# EAGLE design T3HornetV2 (EAGLE 6.5.0)
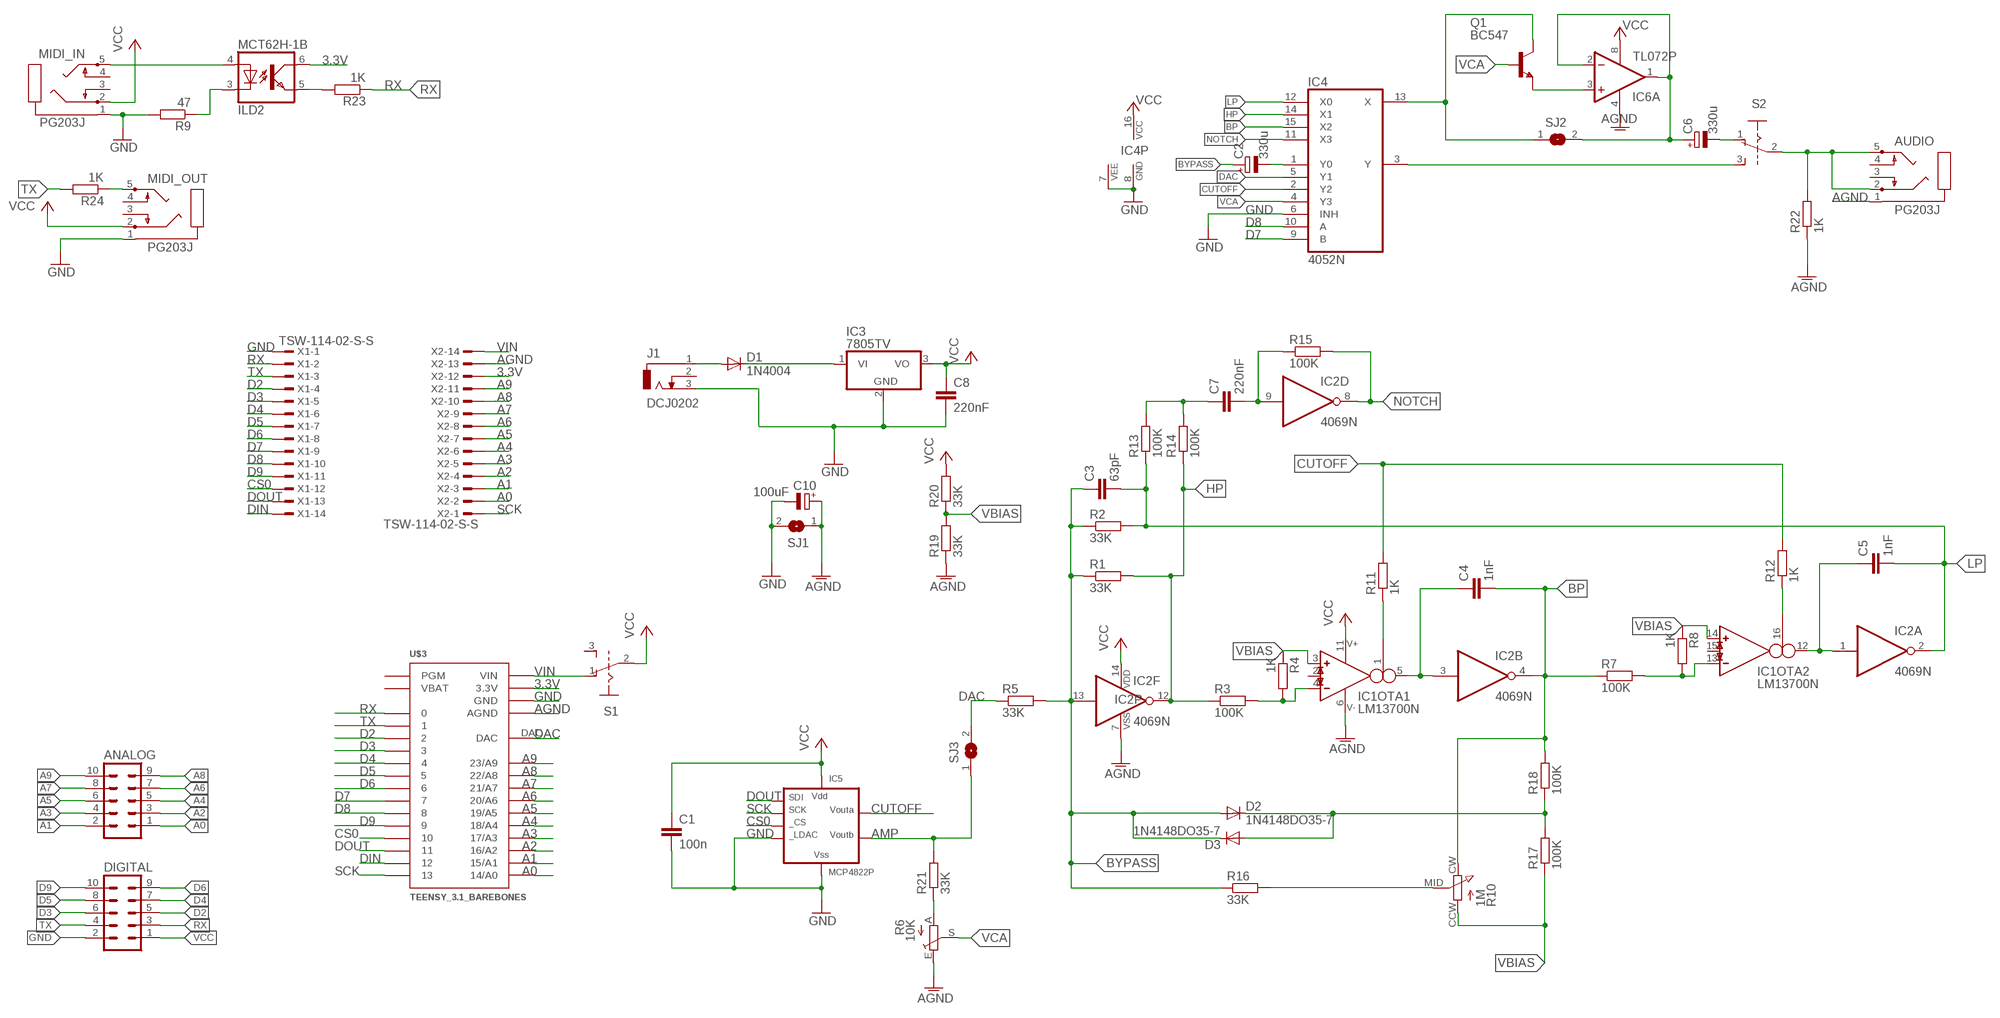
[diagram p0: schematic, sheet 1]

## Parts
ANALOG  ML10  [ML10]
AUDIO  PG203J  [PG203J]
C1  100n  C-EU050-030X075  [C050-030X075]
C2  330u  CPOL-EUE2.5-7  [E2,5-7]
C3  63pF  C-EU025-024X044  [C025-024X044]
C4  1nF  C-EU025-024X044  [C025-024X044]
C5  1nF  C-EU025-024X044  [C025-024X044]
C6  330u  CPOL-EUE2.5-7  [E2,5-7]
C7  220nF  C-EU050-030X075  [C050-030X075]
C8  220nF  C-EU050-030X075  [C050-030X075]
C10  100uF  CPOL-EUE2.5-6  [E2,5-6]
D1  1N4004  [DO41-10]
D2  1N4148DO35-7  [DO35-7]
D3  1N4148DO35-7  [DO35-7]
DIGITAL  ML10  [ML10]
IC1  LM13700N  [DIL16]
IC2  4069N  [DIL14]
IC3  7805TV  [TO220V]
IC4  4052N  [DIL16]
IC5  MCP4822P  [DIL8]
IC6  TL072P  [DIL08]
J1  DCJ0202  [DCJ0202]
MCT62H-1  ILD2  [DIL08]
MIDI_IN  PG203J  [PG203J]
MIDI_OUT  PG203J  [PG203J]
Q1  BC547  [TO92]
R1  33K  R-EU_0207/7  [0207/7]
R2  33K  R-EU_0207/7  [0207/7]
R3  100K  R-EU_0207/7  [0207/7]
R4  1K  R-EU_0207/7  [0207/7]
R5  33K  R-EU_0207/7  [0207/7]
R6  10K  TRIM_EU-CA9V  [CA9V]
R7  100K  R-EU_0207/7  [0207/7]
R8  1K  R-EU_0207/7  [0207/7]
R9  47  R-EU_0207/7  [0207/7]
R10  1M  P120PK  [P120PK]
R11  1K  R-EU_0207/7  [0207/7]
R12  1K  R-EU_0207/7  [0207/7]
R13  100K  R-EU_0207/7  [0207/7]
R14  100K  R-EU_0207/7  [0207/7]
R15  100K  R-EU_0207/7  [0207/7]
R16  33K  R-EU_0207/7  [0207/7]
R17  100K  R-EU_0207/7  [0207/7]
R18  100K  R-EU_0207/7  [0207/7]
R19  33K  R-EU_0207/7  [0207/7]
R20  33K  R-EU_0207/7  [0207/7]
R21  33K  R-EU_0207/7  [0207/7]
R22  1K  R-EU_0207/7  [0207/7]
R23  1K  R-EU_0207/7  [0207/7]
R24  1K  R-EU_0207/7  [0207/7]
S1  EG1218  [GF-126-0159]
S2  EG1218  [GF-126-0159]
SJ1  SJ  [SJ]
SJ2  SJ  [SJ]
SJ3  SJ  [SJ]
U$3  TEENSY_3.1_BAREBONES  [TEENSY_3.1_BAREBONES]
X1  TSW-114-02-S-S  [TSW-114-02-S-S]
X2  TSW-114-02-S-S  [TSW-114-02-S-S]

## Nets
3.3V [power]: MCT62H-1.6(B:COL) U$3.3.3V1(3.3V) U$3.3.3V2(3.3V) X2.12
A0: ANALOG.1 U$3.14/A0 X2.2
A1: ANALOG.2 U$3.15/A1 X2.3
A2: ANALOG.3 U$3.16/A2 X2.4
A3: ANALOG.4 U$3.17/A3 X2.5
A4: ANALOG.5 U$3.18/A4 X2.6
A5: ANALOG.6 U$3.19/A5 X2.7
A6: ANALOG.7 U$3.20/A6 X2.8
A7: ANALOG.8 U$3.21/A7 X2.9
A8: ANALOG.9 U$3.22/A8 X2.10
A9: ANALOG.10 U$3.23/A9 X2.11
AGND [power]: AUDIO.1 C10.+ IC1.6(SUPPLY:V-) IC2.7(P:VSS) IC6.4(P:V-) R6.E R19.1 R22.1 SJ1.1 U$3.AGND X2.13
AMP: IC5.6(VOUTB) R21.2 SJ3.1
BP: C4.2 IC2.4(B:O) IC4.15(X2) R7.1 R10.CW R18.2
BYPASS: C2.+ C3.1 D2.A D3.C IC2.13(F:I) R1.1 R2.1 R5.2 R16.1
CS0: IC5.2(CS) U$3.10 X1.12
CUTOFF: IC4.2(Y2) IC5.8(VOUTA) R11.2 R12.2
D2: DIGITAL.5 U$3.2 X1.4
D3: DIGITAL.6 U$3.3 X1.5
D4: DIGITAL.7 U$3.4 X1.6
D5: DIGITAL.8 U$3.5 X1.7
D6: DIGITAL.9 U$3.6 X1.8
D7: IC4.9(B) U$3.7 X1.9
D8: IC4.10(A) U$3.8 X1.10
D9: DIGITAL.10 U$3.9 X1.11
DAC: IC4.5(Y1) R5.1 SJ3.2 U$3.DAC
DIN: U$3.12 X1.14
DOUT: IC5.4(SDI) U$3.11 X1.13
GND [power]: C1.2 C8.2 C10.- DIGITAL.2 IC3.2(GND) IC4.6(INH) IC4.7(VEE) IC4.8(GND) IC5.5(LDAC) IC5.7(VSS) J1.3 MIDI_IN.1 MIDI_OUT.1 R9.2 SJ1.2 U$3.GND1(GND) U$3.GND2(GND) X1.1
HP: IC2.12(F:O) IC4.14(X1) R1.2 R3.1 R14.1
LP: C3.2 C5.2 IC2.2(A:O) IC4.12(X0) R2.2 R13.1
N$1: D1.A J1.1
N$2: IC6.3(A:+IN) Q1.1(E)
N$3: D2.C D3.A R17.2 R18.1
N$4: R6.A R21.1
N$5: IC1.4(OTA1:IN_N) R3.2 R4.2
N$6: C6.- S2.1
N$7: C4.1 IC1.5(OTA1:OUT) IC2.3(B:I)
N$8: R10.MID R16.2
N$9: IC1.13(OTA2:IN_N) R7.2 R8.2
N$10: IC4.3(Y) S2.3
N$11: C5.1 IC1.12(OTA2:OUT) IC2.1(A:I)
N$12: C7.2 IC2.9(D:I) R15.1
N$13: IC1.1(OTA1:I_BIAS) R11.1
N$14: IC1.16(OTA2:I_BIAS) R12.1
N$15: C7.1 R13.2 R14.2
N$16: D1.C IC3.1(VI)
N$17: C6.+ IC6.1(A:OUT) IC6.2(A:-IN) SJ2.2
N$18: C2.- IC4.1(Y0)
N$19: AUDIO.2 AUDIO.5 R22.2 S2.2
N$20: IC4.13(X) Q1.3(C) SJ2.1
N$21: MCT62H-1.5(B:EMIT) R23.2
N$22: MIDI_OUT.5 R24.1
N$23: MCT62H-1.4(B:A) MIDI_IN.5
N$27: MCT62H-1.3(B:C) R9.1
NOTCH: IC2.8(D:O) IC4.11(X3) R15.2
RX: DIGITAL.3 R23.1 U$3.0 X1.2
SCK: IC5.3(SCK) U$3.13 X2.1
TX: DIGITAL.4 R24.2 U$3.1 X1.3
VBIAS: IC1.3(OTA1:IN_P) IC1.14(OTA2:IN_P) R4.1 R8.1 R10.CCW R17.1 R19.2 R20.1
VCA: IC4.4(Y3) Q1.2(B) R6.S
VCC: C1.1 C8.1 DIGITAL.1 IC1.11(SUPPLY:V+) IC2.14(P:VDD) IC3.3(VO) IC4.16(VCC) IC5.1(VDD) IC6.8(P:V+) MIDI_IN.2 MIDI_OUT.2 R20.2 S1.2
VIN: S1.1 U$3.VIN X2.14
Unconnected: AUDIO.3 AUDIO.4 IC1.2(OTA1:I_DIODE) IC1.7(BUF1:B) IC1.8(BUF1:E) IC1.9(BUF2:E) IC1.10(BUF2:B) IC1.15(OTA2:I_DIODE) IC2.5(C:I) IC2.6(C:O) IC2.10(E:O) IC2.11(E:I) IC6.5(B:+IN) IC6.6(B:-IN) IC6.7(B:OUT) J1.2 MCT62H-1.1(A:A) MCT62H-1.2(A:C) MCT62H-1.7(A:COL) MCT62H-1.8(A:EMIT) MIDI_IN.3 MIDI_IN.4 MIDI_OUT.3 MIDI_OUT.4 S1.3 U$3.PGM

## Power pins joined to a net without a drawn wire
VBAT: U$3.VBAT

## Library data of the parts
ANALOG DIGITAL = con-harting-ml:ML10: HARTING
AUDIO MIDI_IN MIDI_OUT = con-hirschmann:PG203J: MIC/HEADPHONE JACK KS-S stereo microphone/headphone jack PG203JN (Schukat)
C1 C3-C5 C7 C8 = rcl:C-EU: CAPACITOR, European symbol
C2 C6 C10 = rcl:CPOL-EU: POLARIZED CAPACITOR, European symbol
D1 = diode:1N4004: DIODE general purpose rectifier, 1 A
D2 D3 = diode:1N4148: DIODE high speed (Philips)
IC1 = ota:LM13700: Dual OTA with buffers
IC2 = 40xx:4069: Hex INVERTER
IC3 = linear:78*: Positive VOLTAGE REGULATOR Source: http://cache.national.com/ds/LM/LM78L05.pdf http://www.fairchildsemi.com/ds/LM/LM7805.pdf
IC4 = 40xx:4052: Dual 4-channel ANALOG MULTIPLEXER
IC5 = microchip-dac:MCP4822: MCP4822: 12-bit dual DAC MCP4802/4812/4822 - 8/10/12-Bit Dual Voltage Output Digital-to-Analog Converter with Internal VREF and SPI Interface The MCP48x2 devices are dual 8-bit, 10-bit and 12-bit buffered voltage output Digital-to-Analog Converters (DACs), respectively. The devices operate from a single 2.7V to 5.5V supply with SPI compatible Serial Peripheral Interface. The devices have a high precision internal voltage reference (VREF = 2.048V). The user can configure the full-scale range of the device to be 2.048V or 4.096V by setting the Gain Selection Option bit (gain of 1 of 2). RobG
IC6 = linear:TL072: OP AMP
J1 = con-jack:DCJ0202: DC POWER JACK Source: DCJ0202.pdf; OC_FARNELL: unknown; OC_NEWARK: unknown
MCT62H-1 = optocoupler:ILD2: SIEMENS OPTO COUPLER; OC_FARNELL: 1469596; OC_NEWARK: unknown
Q1 = transistor-npn:BC547*: NPN Transistor
R1-R5 R7-R9 R11-R24 = rcl:R-EU_: RESISTOR, European symbol
R6 = pot:TRIM_EU-: POTENTIOMETER
R10 = videomusik:P120PK
S1 S2 = videomusik:EG1218
SJ1-SJ3 = jumper:SJ: SMD solder JUMPER
U$3 = Teensy3.0:TEENSY_3.1_BAREBONES
X1 X2 = con-samtec:TSW-114-02-S-S: THROUGH-HOLE .025" SQ POST HEADER Source: Samtec TSW.pdf; OC_FARNELL: unknown; OC_NEWARK: unknown

## Net classes
1 power: width 0.61 mm

## Board
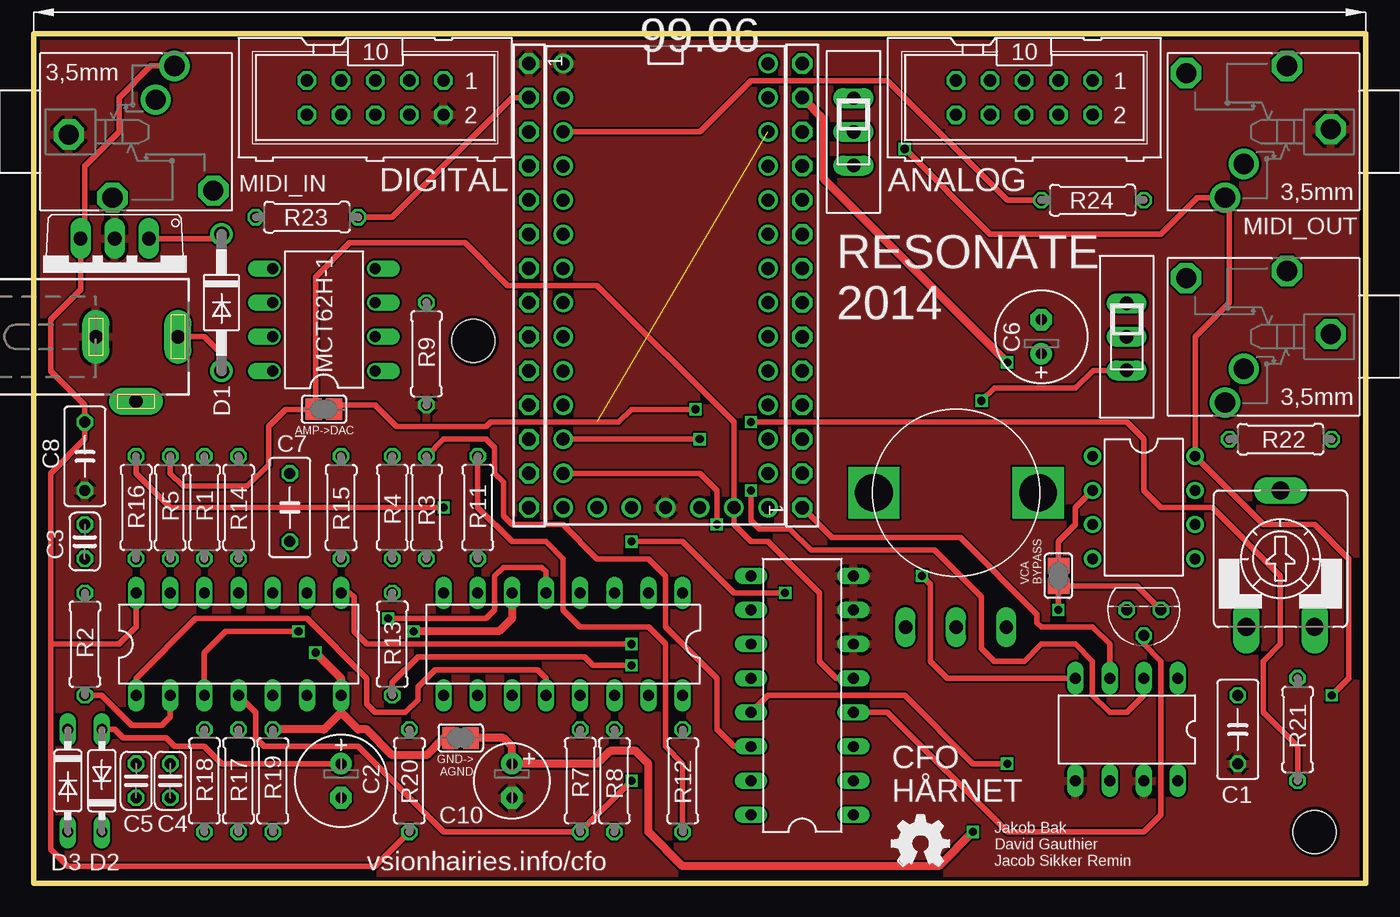
[diagram p1: board, top side]
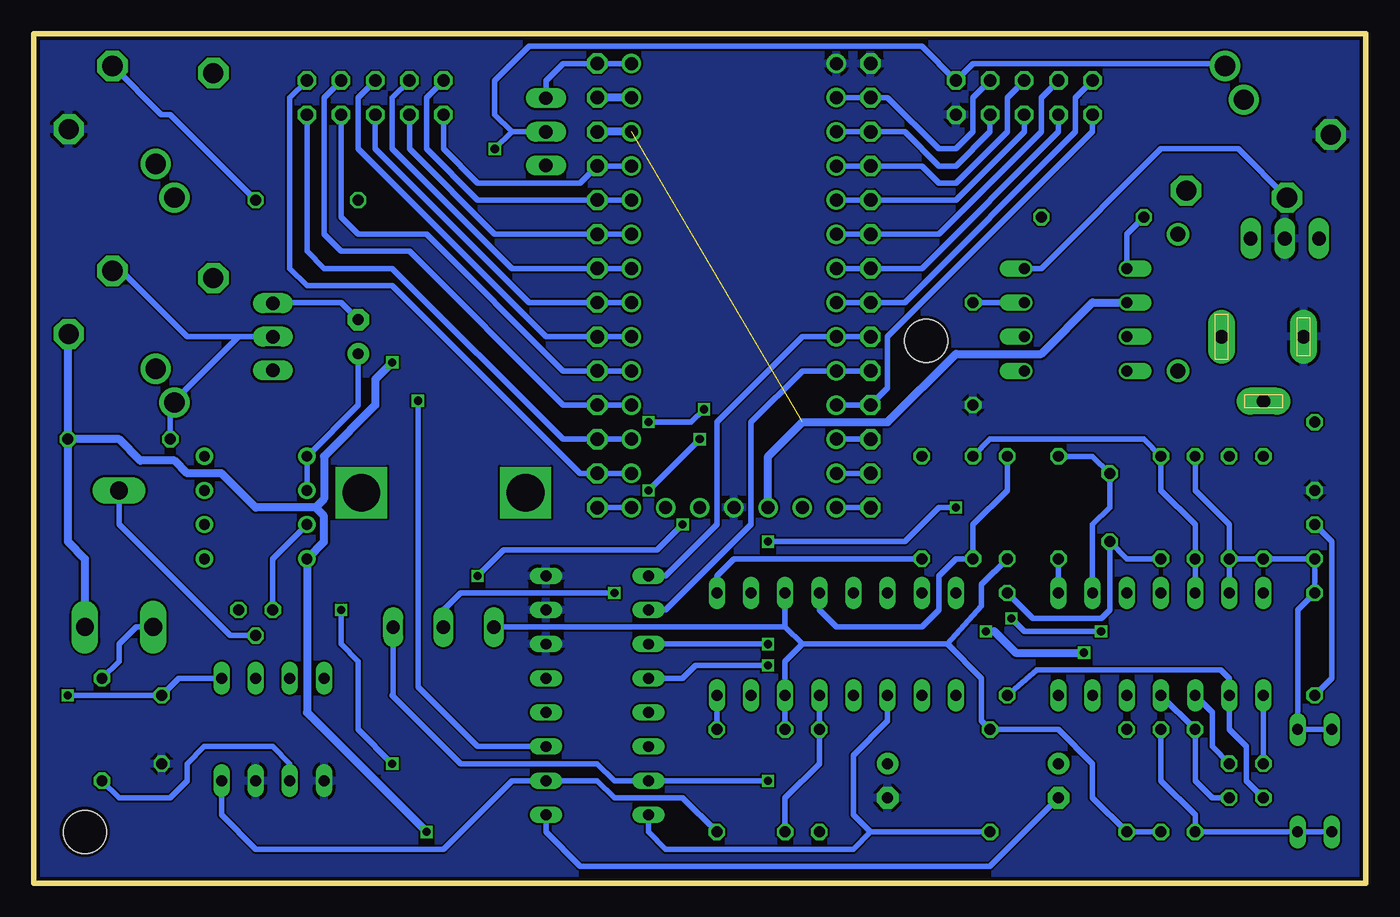
[diagram p2: board, bottom side, seen from below]

Size 99.06 x 63.18 mm. Coordinates in mm from the lower left corner, seen from the top.
Outline: 0,0 99.06,0 99.06,63.18 0,63.17 0,0
Copper layers (1*2*15*16): Top 0.035mm / dielectric 0.2mm / layer 2 0.0175mm / dielectric 1.1mm / layer 15 0.0175mm / dielectric 0.2mm / Bottom 0.035mm
Design rules "SeeedStudio_DRU_no_angle_20130527": minimum track width 6mil, minimum drill 12mil, track to track 6mil, track to pad 6mil, pad to pad 6mil, via to via 6mil, smd to smd 0mil, copper to edge 10mil, drill to drill 10mil, minimum pad ring 6mil, minimum via ring 6mil, stop-mask expansion 2mil, vias tented up to drill 25mil, thermal gap 10mil
Holes 3.2 mm at 95.25,3.81 32.7,40.32

### Footprints (pad centres in the part's own frame; a part is rotated, then mirrored left to right if it is on the bottom)
ML10 = drill 0.914 octagon: 1 -5.08,-1.27; 2 -5.08,1.27; 3 -2.54,-1.27; 4 -2.54,1.27; 5 0,-1.27; 6 0,1.27; 7 2.54,-1.27; 8 2.54,1.27; 9 5.08,-1.27; 10 5.08,1.27
PG203J = drill 1.499 octagon: 1 -5.004,-0.203; 4 5.74,-4.369; 5 -1.753,-4.902 | drill 1.499: 2 2.845,4.902; 3 1.448,2.388
C050-030X075 = drill 0.813 octagon: 1 -2.54,0; 2 2.54,0
E2,5-7 = drill 0.813 pad 1.6: + -1.27,0 | drill 0.813 pad 1.6 octagon: - 1.27,0
C025-024X044 = drill 0.813 octagon: 1 -1.27,0; 2 1.27,0
E2,5-6 = drill 0.813 pad 1.6: + -1.27,0 | drill 0.813 pad 1.6 octagon: - 1.27,0
DO41-10 = drill 1.118: A 5.08,0; C -5.08,0
DO35-7 = drill 0.813 long: A 3.81,0; C -3.81,0
DIL16 = drill 0.813 long: 1 -8.89,-3.81; 2 -6.35,-3.81; 3 -3.81,-3.81; 4 -1.27,-3.81; 5 1.27,-3.81; 6 3.81,-3.81; 7 6.35,-3.81; 8 8.89,-3.81; 9 8.89,3.81; 10 6.35,3.81; 11 3.81,3.81; 12 1.27,3.81; 13 -1.27,3.81; 14 -3.81,3.81; 15 -6.35,3.81; 16 -8.89,3.81
DIL14 = drill 0.813 long: 1 -7.62,-3.81; 2 -5.08,-3.81; 3 -2.54,-3.81; 4 0,-3.81; 5 2.54,-3.81; 6 5.08,-3.81; 7 7.62,-3.81; 8 7.62,3.81; 9 5.08,3.81; 10 2.54,3.81; 11 0,3.81; 12 -2.54,3.81; 13 -5.08,3.81; 14 -7.62,3.81
TO220V = drill 1.016 long: 1 -2.54,-2.54; 2 0,-2.54; 3 2.54,-2.54
DIL8 = drill 0.813 long: 1 -3.81,-3.81; 2 -1.27,-3.81; 3 1.27,-3.81; 4 3.81,-3.81; 5 3.81,3.81; 6 1.27,3.81; 7 -1.27,3.81; 8 -3.81,3.81
DIL08 = drill 0.813 pad 1.27: 1 -3.81,-3.81; 2 -1.27,-3.81; 3 1.27,-3.81; 4 3.81,-3.81; 5 3.81,3.81; 6 1.27,3.81; 7 -1.27,3.81; 8 -3.81,3.81
DCJ0202 = drill 1 pad 2 long: 1 0,3.1; 2 4.8,0; 3 0,-3
DIL08' = drill 0.813 offset: 1 -3.81,-3.81; 2 -1.27,-3.81; 3 1.27,-3.81; 4 3.81,-3.81; 5 3.81,3.81; 6 1.27,3.81; 7 -1.27,3.81; 8 -3.81,3.81
TO92 = drill 0.813 octagon: 1 1.27,0; 2 0,1.905; 3 -1.27,0
0207/7 = drill 0.813 octagon: 1 -3.81,0; 2 3.81,0
CA9V = drill 1.321 long: A -2.54,-5.08; E 2.54,-5.08; S 0,5.08
P120PK = drill 1 long: CCW -3.75,0; CW 3.75,0; MID 0,0 | drill 2.8 square: LEFTLEG -6.1,10; RIGHTLEG 6.1,10
GF-126-0159 = drill 1 long: 1 -2.5,0; 2 0,0; 3 2.5,0
SJ = smd 1.168 x 1.6: 1 -0.762,0; 2 0.762,0
TEENSY_3.1_BAREBONES = drill 0.965: 0 -7.62,13.97; 1 -7.62,11.43; 2 -7.62,8.89; 3 -7.62,6.35; 3.3V1 7.62,11.43; 3.3V2 -2.54,-16.51; 4 -7.62,3.81; 5 -7.62,1.27; 6 -7.62,-1.27; 7 -7.62,-3.81; 8 -7.62,-6.35; 9 -7.62,-8.89; 10 -7.62,-11.43; 11 -7.62,-13.97; 12 -7.62,-16.51; 13 7.62,-16.51; 14/A0 7.62,-13.97; 15/A1 7.62,-11.43; 16/A2 7.62,-8.89; 17/A3 7.62,-6.35; 18/A4 7.62,-3.81; 19/A5 7.62,-1.27; 20/A6 7.62,1.27; 21/A7 7.62,3.81; 22/A8 7.62,6.35; 23/A9 7.62,8.89; AGND 7.62,13.97; DAC 5.08,-16.51; GND1 -7.62,16.51; GND2 0,-16.51; PGM 2.54,-16.51; VBAT -5.08,-16.51; VIN 7.62,16.51
TSW-114-02-S-S = drill 1 pad 1.5 octagon: 1 16.51,0; 2 13.97,0; 3 11.43,0; 4 8.89,0; 5 6.35,0; 6 3.81,0; 7 1.27,0; 8 -1.27,0; 9 -3.81,0; 10 -6.35,0; 11 -8.89,0; 12 -11.43,0; 13 -13.97,0; 14 -16.51,0

### Placement (x,y rotation side)
ANALOG  73.66,58.42 180 top
AUDIO  91.44,40.64 180 top
C1  89.53,11.43 270 top
C2  22.86,7.62 270 top
C3  3.81,25.4 90 top
C4  10.16,7.62 270 top
C5  7.62,7.62 270 top
C6  74.93,40.64 90 top
C7  19.05,27.94 90 top
C8  3.81,31.75 270 top
C10  35.56,7.62 270 top
D1  13.97,43.18 270 top
D2  5.08,7.62 90 top
D3  2.54,7.62 270 top
DIGITAL  25.4,58.42 180 top
IC1  39.37,17.78 180 top
IC2  15.24,17.78 0 top
IC3  6.03,45.4 180 top
IC4  57.15,13.97 90 top
IC5  81.28,11.43 180 top
IC6  82.55,27.94 270 top
J1  7.62,40.64 270 top
MCT62H-1  ILD2  [DIL08']  21.59,41.91 90 top
MIDI_IN  7.62,55.88 0 top
MIDI_OUT  91.44,55.88 180 top
Q1  82.55,20.32 180 top
R1  12.7,27.94 270 top
R2  3.81,17.78 270 top
R3  29.21,27.94 270 top
R4  26.67,27.94 90 top
R5  10.16,27.94 270 top
R6  92.71,24.13 0 top
R7  40.64,7.62 90 top
R8  43.18,7.62 270 top
R9  29.21,39.37 270 top
R10  68.58,19.05 0 top
R11  33.02,27.94 90 top
R12  48.26,7.62 270 top
R13  26.67,17.78 90 top
R14  15.24,27.94 270 top
R15  22.86,27.94 270 top
R16  7.62,27.94 90 top
R17  15.24,7.62 90 top
R18  12.7,7.62 90 top
R19  17.78,7.62 270 top
R20  27.94,7.62 270 top
R21  93.98,11.43 270 top
R22  92.71,33.02 180 top
R23  20.32,49.53 180 top
R24  78.74,50.8 180 top
S1  60.96,55.88 270 top
S2  81.28,40.64 270 top
SJ1  31.75,10.79 180 top
SJ2  76.2,22.86 90 top
SJ3  21.59,35.24 180 top
U$1  [OSHW_FILLX150_NOTEXT]  63.82,1.27 0 top
U$3  46.99,44.45 0 top
X1  36.83,44.45 90 top
X2  57.15,44.45 270 top

### Tracks (layer width: path | path; a pad name or v marks a point on that pad's centre or on a via)
3.3V  (1 unrouted)
  Bottom 0.61: U$3.3.3V1 X2.12 | U$3.3.3V2 44.45,31.75 41.91,34.29 35.56,34.29 30.48,39.37 24.13,39.37 20.32,43.18 MCT62H-1.6
A0
  Bottom 0.406: U$3.14/A0 X2.2 58.42,30.48 72.39,44.45 78.74,44.45 80.01,45.72 80.01,58.42 ANALOG.1
A1
  Bottom 0.406: U$3.15/A1 X2.3 59.69,33.02 72.39,45.72 77.47,45.72 78.74,46.99 ANALOG.2
A2
  Bottom 0.406: U$3.16/A2 X2.4 59.69,35.56 71.12,46.99 76.2,46.99 77.47,48.26 77.47,58.42 ANALOG.3
A3
  Bottom 0.406: U$3.17/A3 X2.5 59.69,38.1 69.85,48.26 74.93,48.26 76.2,49.53 ANALOG.4
A4
  Bottom 0.406: U$3.18/A4 X2.6 60.96,40.64 74.93,54.61 74.93,58.42 ANALOG.5
A5
  Bottom 0.406: U$3.19/A5 X2.7 62.23,43.18 73.66,54.61 ANALOG.6
A6
  Bottom 0.406: U$3.20/A6 X2.8 63.5,45.72 72.39,54.61 72.39,58.42 ANALOG.7
A7
  Bottom 0.406: U$3.21/A7 X2.9 64.77,48.26 71.12,54.61 ANALOG.8
A8
  Bottom 0.406: U$3.22/A8 X2.10 66.04,50.8 69.85,54.61 69.85,58.42 ANALOG.9
A9
  Bottom 0.406: U$3.23/A9 X2.11 58.42,52.07 66.04,52.07 68.58,54.61 ANALOG.10
AGND  (via drill 0.6)
  Top 0.61: IC1.6 35.56,19.68 34.61,18.73 v28.26,18.73 | v20.95,17.14 22.86,15.24 IC2.7 22.86,12.7 | 22.86,12.7 21.59,11.43 R19.1 | 22.86,12.7 24.13,11.43 24.77,11.43 26.67,9.53 29.21,9.53 30.48,10.79 SJ1.1 34.92,10.79 35.56,10.16 C10.+ 41.91,8.89 42.86,9.84 44.77,9.84 45.72,8.89 45.72,3.81 48.26,1.27 67.31,1.27 v69.85,3.81 | X2.13 58.74,56.83 58.74,52.39 v72.39,38.73
  Bottom 0.61: AUDIO.1 96.52,40.77 R22.1 | U$3.AGND X2.13 | R22.1 96.52,25.4 95.25,24.13 R6.E | v28.26,18.73 27.62,18.73 26.04,17.14 v20.95,17.14 | 78.11,27.94 77.47,27.3 77.47,25.4 IC6.4 78.74,12.7 v69.85,3.81 | 78.11,27.94 82.55,27.94 85.09,30.48 87.63,30.48 88.58,31.43 91.12,31.43 92.71,33.02 R22.1 | v72.39,38.73 73.66,37.47 73.66,35.56 77.47,31.75 77.47,28.57 78.11,27.94
AMP  (via drill 0.6)
  Top 0.406: SJ3.1 22.67,35.56 25.4,35.56 26.99,33.97 33.66,33.97 33.97,34.29 43.5,34.29 44.45,35.24 v49.21,35.24 | v53.34,34.29 81.28,34.29 82.55,33.02 82.55,29.21 83.82,27.94 87.63,27.94 92.71,22.86 92.71,17.78 91.44,16.51 91.44,12.7 93.98,10.16 R21.2
  Bottom 0.406: R21.2 92.71,6.35 88.9,6.35 87.63,7.62 87.63,8.89 86.36,10.16 81.28,10.16 80.01,8.89 IC5.6 | v49.21,35.24 50.16,34.29 v53.34,34.29
BP  (via drill 0.6)
  Top 0.406: v44.45,7.62 R7.1 30.48,3.81 24.13,10.16 17.14,10.16 16.51,10.79 16.51,12.7 IC2.4
  Bottom 0.406: C4.2 11.43,6.35 12.7,7.62 R18.2 IC2.4 | R10.CW 72.33,14.03 72.39,13.97 67.31,8.89 57.15,8.89 55.88,7.62 IC4.15 v44.45,7.62
BYPASS
  Top 0.406: C2.+ 13.97,8.89 12.7,10.16 10.48,10.16 9.84,10.79 6.67,10.79 6.03,11.43 D2.A
  Bottom 0.406: D3.C D2.A 5.08,20.32 R2.1 C3.1 R16.1 R5.2 | R5.2 IC2.13 | R5.2 10.16,26.67 12.7,29.21 R1.1
CS0  (via drill 0.6)
  Top 0.406: IC5.2 82.55,13.97 81.28,12.7 80.01,12.7 78.74,13.97 78.74,16.51 77.47,17.78 74.93,17.78 73.66,16.51 71.44,16.51 70.48,17.46 70.48,21.27 66.99,24.77 57.78,24.77 56.2,26.35 53.98,26.35 53.34,26.99 v53.34,29.21 | v49.53,33.02 U$3.10
  Bottom 0.406: U$3.10 X1.12 | v53.34,29.21 v49.53,33.02
CUTOFF
  Top 0.406: R12.2 48.26,8.89 46.99,10.16 46.99,17.78 45.72,19.05 40.64,19.05 39.37,20.32 39.37,24.13 38.1,25.4 35.56,25.4 33.02,27.94 R11.2
  Bottom 0.406: IC5.8 85.09,5.08 82.55,2.54 68.58,2.54 63.5,7.62 IC4.2 57.15,7.62 55.88,6.35 50.8,6.35 R12.2
D2
  Bottom 0.406: U$3.2 X1.4 33.02,53.34 31.75,52.07 30.48,52.07 26.67,55.88 26.67,58.42 DIGITAL.5
D3
  Bottom 0.406: U$3.3 X1.5 30.48,50.8 25.4,55.88 DIGITAL.6
D4
  Bottom 0.406: U$3.4 X1.6 31.75,48.26 24.13,55.88 24.13,58.42 DIGITAL.7
D5
  Bottom 0.406: U$3.5 X1.7 33.02,45.72 22.86,55.88 DIGITAL.8
D6
  Bottom 0.406: U$3.6 X1.8 34.29,43.18 21.59,55.88 21.59,58.42 DIGITAL.9
D7
  Bottom 0.406: X1.9 U$3.7 41.91,40.64 48.26,34.29 48.26,26.67 52.07,22.86 IC4.9
D8
  Bottom 0.406: X1.10 U$3.8 41.91,38.1 45.72,34.29 45.72,26.67 52.07,20.32 IC4.10
D9
  Bottom 0.406: U$3.9 X1.11 35.56,36.83 35.56,40.64 20.32,55.88 DIGITAL.10
DAC
  Top 0.406: IC4.5 59.69,15.24 58.42,16.51 58.42,21.59 54.61,25.4 53.34,25.4 52.07,26.67 U$3.DAC 52.07,34.29 41.91,44.45 35.24,44.45 32.07,47.62 23.5,47.62 20.95,45.09 20.95,35.37 SJ3.2 18.73,35.24 17.46,33.97 17.46,31.11 15.88,29.53 11.11,29.53 10.16,30.48 R5.1
DIN
  Bottom 0.406: U$3.12 X1.14
DOUT  (via drill 0.6)
  Top 0.406: U$3.11 49.53,30.48 50.8,29.21 v50.8,26.67 | v66.04,22.86 66.67,22.23 66.67,16.51 67.94,15.24 IC5.4
  Bottom 0.406: U$3.11 X1.13 | v50.8,26.67 52.7,24.77 64.14,24.77 v66.04,22.86
GND
  pour Bottom: -1.91,-2.22 -1.91,64.45 102.87,64.45 102.87,-2.22
  pour Top: -0.95,63.82 -0.95,-0.95 101.6,-0.95 101.6,63.82
HP
  Top 0.406: IC4.14 52.07,10.16 50.8,11.43 50.8,15.24 46.99,19.05 46.99,22.86 45.72,24.13 41.91,24.13 39.37,26.67 35.56,26.67 34.92,27.3 34.92,29.84 34.29,30.48 34.29,32.38 33.66,33.02 30.48,33.02 R3.1
  Bottom 0.406: IC2.12 R1.2 12.7,26.67 15.24,29.21 R14.1 16.51,33.02 27.94,33.02 R3.1
LP  (via drill 0.6)
  Top 0.406: R2.2 5.08,13.97 7.3,11.75 9.53,11.75 10.16,12.38 IC2.2 | R13.1 26.67,14.92 28.57,16.83 40.96,16.83 41.59,16.19 v44.45,16.19
  Bottom 0.406: C5.2 8.89,7.62 8.89,10.16 10.16,11.43 IC2.2 10.16,15.24 10.79,15.88 24.45,15.88 R13.1 | C3.2 2.54,25.4 2.54,15.24 R2.2 | IC4.12 50.8,15.24 49.85,16.19 v44.45,16.19
N$1
  Top 0.406: J1.1 12.7,40.64 13.97,39.37 D1.A
N$2
  Bottom 0.406: Q1.1 81.28,24.13 IC6.3
N$3
  Bottom 0.406: D3.A D2.C R18.1 12.7,5.08 15.24,7.62 R17.2
N$4
  Bottom 0.406: R21.1 92.71,16.51 92.71,17.78 91.44,19.05 R6.A
N$5
  Bottom 0.406: IC1.4 40.64,20.32 39.37,19.05 33.02,19.05 31.75,20.32 31.75,22.86 30.48,24.13 R3.2 29.21,26.67 26.67,29.21 R4.2
N$6
  Bottom 0.406: S2.1 81.24,43.18 76.2,43.18 C6.-
N$7  (via drill 0.6)
  Top 0.406: IC2.3 12.7,17.14 14.29,18.73 v19.68,18.73 | v26.35,19.68 33.66,19.68 34.29,20.32 34.29,22.86 34.92,23.5 37.78,23.5 38.1,23.18 IC1.5
  Bottom 0.406: C4.1 11.43,10.16 11.43,12.7 IC2.3 | v19.68,18.73 25.4,18.73 v26.35,19.68
N$8  (via drill 0.6)
  Top 0.406: R16.2 7.62,30.48 10.16,27.94 v30.48,27.94 | v44.45,25.4 48.26,25.4 52.07,21.59 v55.88,21.59
  Bottom 0.406: v30.48,27.94 31.75,27.94 34.29,25.4 v44.45,25.4 | v55.88,21.59 67.31,21.59 68.58,20.32 R10.MID
N$9
  Bottom 0.406: IC1.13 R7.2 40.64,8.89 43.18,6.35 R8.2
N$10  (via drill 0.6)
  Top 0.406: v70.48,35.88 71.44,36.83 77.47,36.83 78.78,38.14 S2.3
  Bottom 0.406: IC4.3 66.04,10.16 70.48,14.61 v70.48,35.88
N$11
  Top 0.406: IC2.1 7.62,15.24 12.06,19.68 20.32,19.68 24.77,15.24 24.77,13.34 25.4,12.7 27.62,12.7 28.57,13.65 28.57,14.61 29.84,15.88 37.47,15.88 38.1,15.24 IC1.12
  Bottom 0.406: IC2.1 C5.1
N$12
  Bottom 0.406: R15.1 20.32,31.75 C7.2 19.05,27.94 20.32,26.67 IC2.9
N$13
  Bottom 0.406: IC1.1 48.26,22.86 46.99,24.13 R11.1
N$14
  Bottom 0.406: IC1.16 R12.1
N$15
  Bottom 0.406: R14.2 17.78,24.13 C7.1 19.05,20.32 19.68,19.68 24.77,19.68 R13.2
N$16
  Top 0.406: D1.C 13.65,47.94 IC3.1
N$17
  Top 0.406: SJ2.2 76.2,25.4 77.47,26.67 77.47,27.94 IC6.2
  Bottom 0.406: C6.+ 74.93,35.56 IC6.1 IC6.2
N$18
  Bottom 0.406: C2.- 27.94,1.27 58.42,1.27 60.96,3.81 IC4.1
N$19
  Bottom 0.406: R22.2 88.9,35.43 AUDIO.2 88.59,35.87 83.82,40.64 | S2.2 83.82,40.64 | AUDIO.5 92.53,45.54 87.63,40.64 83.82,40.64
N$20  (via drill 0.6)
  Top 0.406: Q1.3 82.04,22.1 SJ2.1 v76.2,20.32 | IC4.13 54.61,13.97 64.77,13.97 69.85,8.89 v72.39,8.89
  Bottom 0.406: v72.39,8.89 74.93,11.43 74.93,16.51 76.2,17.78 v76.2,20.32
N$21
  Bottom 0.406: R23.2 17.78,48.26 MCT62H-1.5
N$22
  Bottom 0.406: R24.1 88.9,57.15 89.56,57.15 MIDI_OUT.5
N$23
  Bottom 0.406: MIDI_IN.5 9.5,54.61 15.24,54.61 24.13,45.72 MCT62H-1.4
N$27
  Bottom 0.406: R9.1 MCT62H-1.3
NOTCH  (via drill 0.6)
  Top 0.406: IC2.8 23.5,21.59 23.81,21.27 23.81,18.73 24.77,17.78 v44.45,17.78
  Bottom 0.406: R15.2 IC2.8 | v44.45,17.78 IC4.11
RX
  Top 0.406: R23.1 26.67,49.53 35.56,58.42 X1.2
  Bottom 0.406: DIGITAL.3 29.21,58.42 29.21,55.88 30.48,54.61 31.75,54.61 35.56,58.42 X1.2 U$3.0
SCK
  Top 0.406: IC5.3 80.01,17.78 78.74,19.05 74.93,19.05 74.61,19.37 74.61,20 68.9,25.72 59.37,25.72 X2.1
  Bottom 0.406: U$3.13 X2.1
TX
  Top 0.406: R24.2 72.39,50.8 63.5,59.69 53.34,59.69 49.53,55.88 U$3.1
  Bottom 0.406: U$3.1 X1.3 34.29,55.88 31.75,53.34 30.48,53.34 27.94,55.88 DIGITAL.4
VBIAS
  Bottom 0.406: R8.1 IC1.14 43.18,16.51 41.91,17.78 | R4.1 28.57,22.23 28.57,20.64 31.11,17.78 | 31.11,17.78 41.91,17.78 | R17.1 R19.2 20.32,6.35 20.32,8.89 22.86,11.43 R20.1 28.57,12.06 28.57,15.24 31.11,17.78 | 41.91,17.78 43.18,19.05 | 43.18,19.05 IC1.3 | 43.18,19.05 R10.CCW
VCA
  Top 0.406: IC4.4 63.5,12.7 72.39,3.81 82.55,3.81 83.82,5.08 83.82,16.51 82.55,17.78 Q1.2
  Bottom 0.406: R6.S 92.71,26.67 84.45,18.41 Q1.2
VCC  (via drill 0.6)
  Top 0.406: 1.27,17.78 1.27,2.54 2.54,1.27 25.4,1.27 R20.2 | IC2.14 7.62,19.05 6.35,17.78 1.27,17.78 | v64.77,54.61 71.12,48.26 83.82,48.26 86.54,50.98 MIDI_OUT.2 88.9,50.67 88.9,43.18 86.36,40.64 IC6.8 91.44,26.67 95.25,26.67 97.79,24.13 97.79,15.24 v96.52,13.97 | MIDI_IN.2 8.71,60.78 6.35,58.42 6.35,55.88 3.81,53.34 3.81,48.26 IC3.3 3.49,44.13 1.27,41.91 1.27,38.1 3.81,35.56 C8.1 3.81,33.02 1.27,30.48 1.27,17.78
  Bottom 0.406: MIDI_IN.2 11.25,60.78 11.43,60.96 29.21,60.96 DIGITAL.1 33.02,62.23 62.23,62.23 64.77,59.69 64.77,57.15 63.5,55.88 | IC5.1 88.27,15.24 C1.1 v96.52,13.97 | S1.2 63.5,55.88 | 63.5,55.88 v64.77,54.61 | IC4.16 53.34,3.81 52.07,2.54 38.1,2.54 36.83,3.81 | 36.83,3.81 R20.2 | IC1.11 35.56,12.06 38.1,9.53 38.1,5.08 36.83,3.81
VIN
  Bottom 0.406: U$3.VIN X2.14 59.69,60.96 60.96,59.69 S1.1

### Text on the board
tNames: RESONATE / 2014 | AMP->DAC | VCA / BYPASS | GND-> / AGND | CFO / HÅRNET | vsionhairies.info/cfo | Jakob Bak / David Gauthier / Jacob Sikker Remin